# Altium schematic sheet 17.SchDoc
size 386 x 246 mm
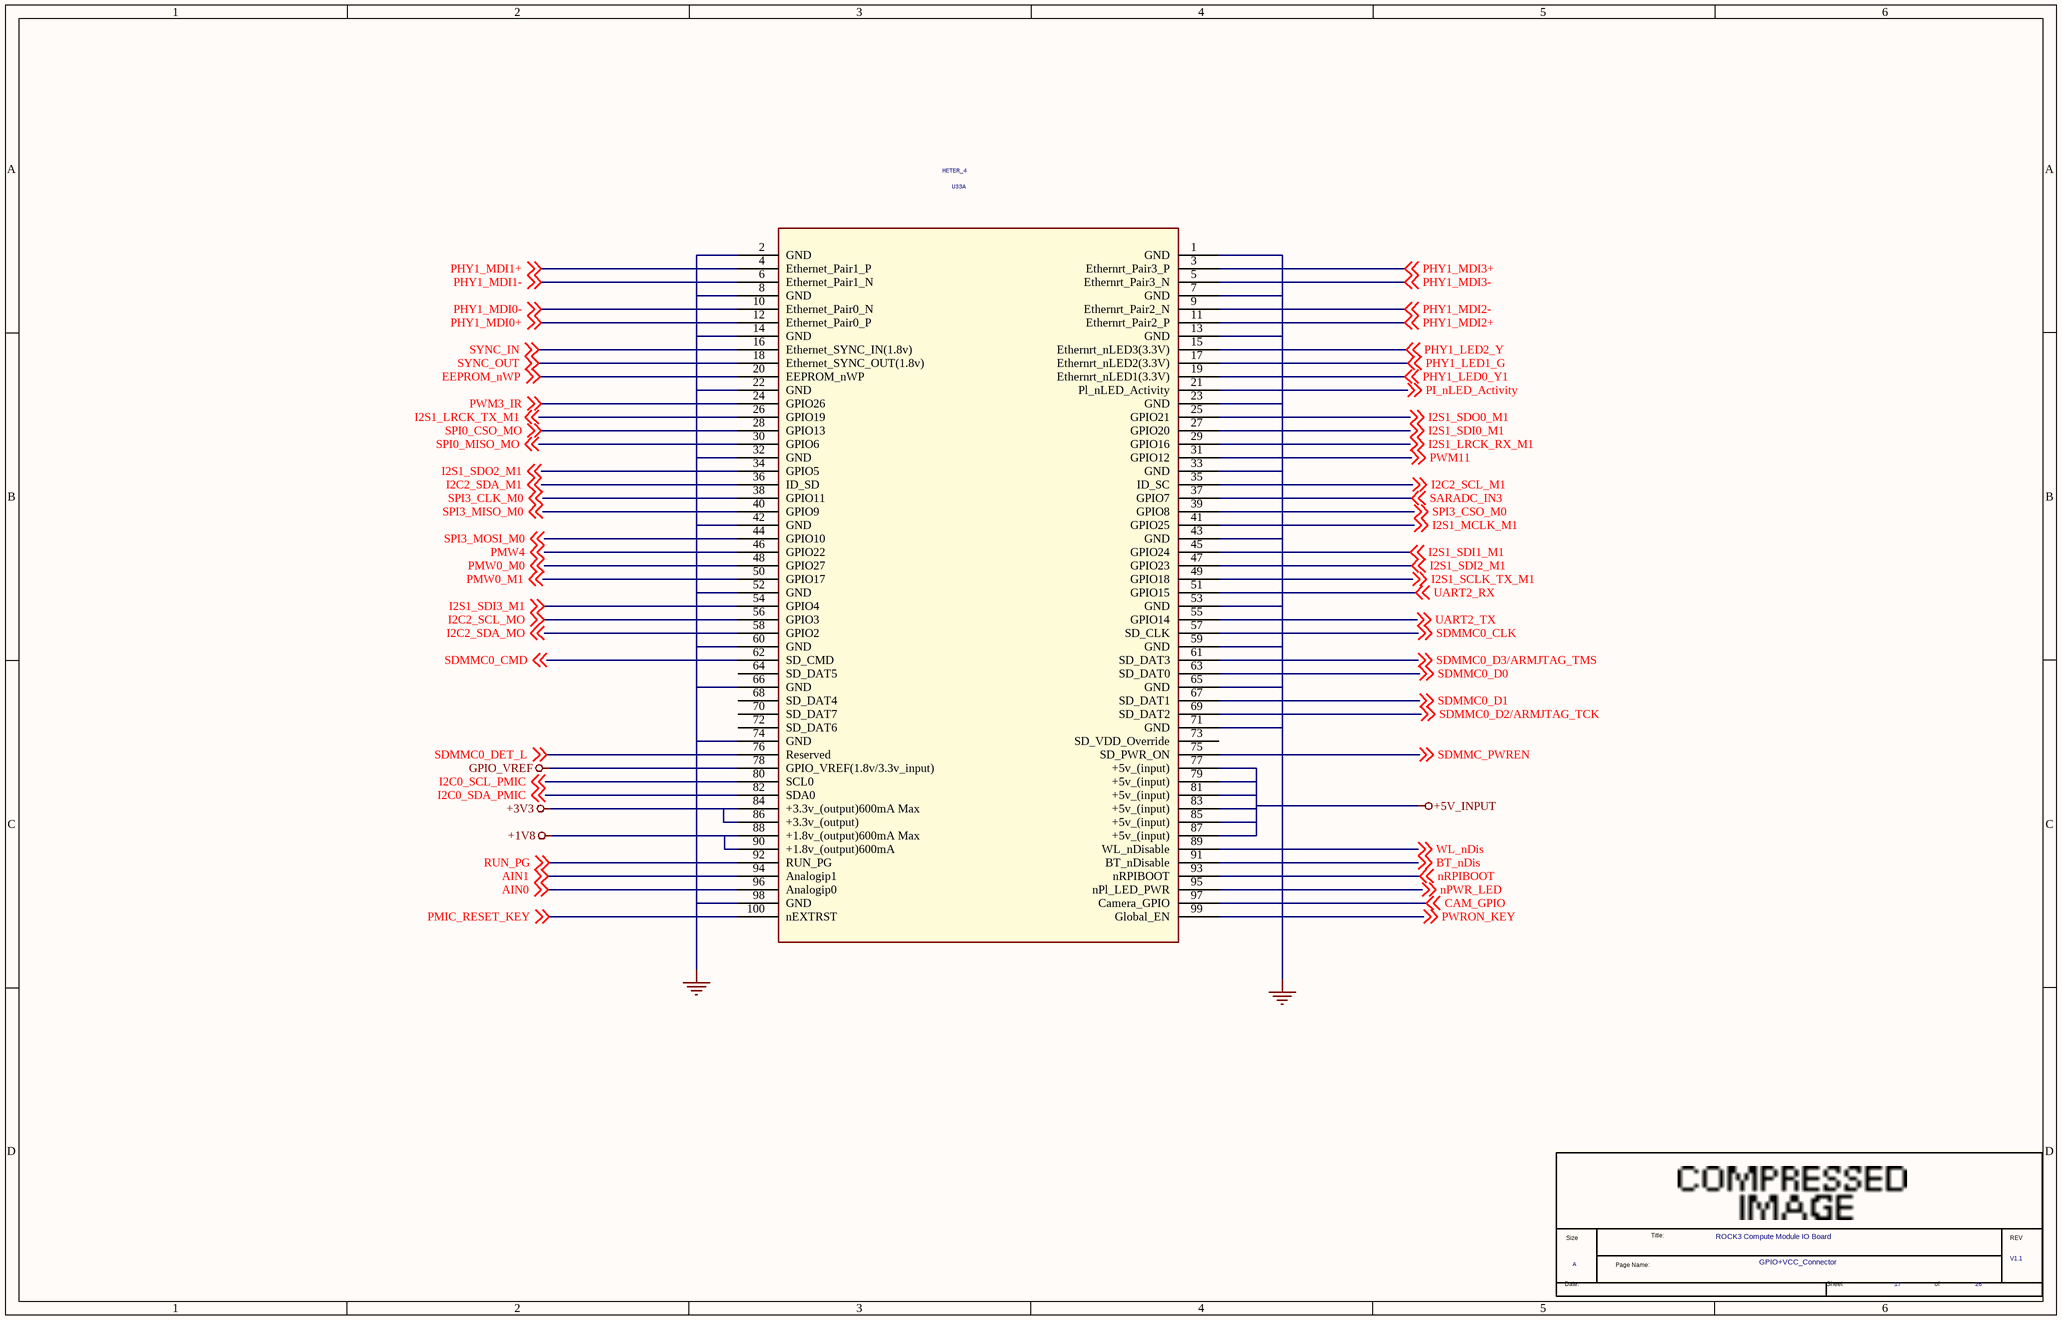
[diagram p0: 17.SchDoc]

## Parts
*  Page Count: 20  Page Number: 17  Page Size: A  Title: ROCK3 Compute Module IO Board  RevCode: V1.1  Doc: GPIO+VCC_Connector  (hidden comment: radxa_gong)  (graphical)
U33  HETER_4  [DF40C-200DS-D4-OK]  (part A of 2)

## Nets
+1V8: U33.88(+1.8v_(output)600mA_Max) U33.90(+1.8v_(output)600mA)
+3V3: U33.84(+3.3v_(output)600mA_Max) U33.86(+3.3v_(output))
+5V_INPUT: U33.77(+5v_(input)) U33.79(+5v_(input)) U33.81(+5v_(input)) U33.83(+5v_(input)) U33.85(+5v_(input)) U33.87(+5v_(input))
GND: U33.1(GND) U33.2(GND) U33.7(GND) U33.8(GND) U33.13(GND) U33.14(GND) U33.22(GND) U33.23(GND) U33.32(GND) U33.33(GND) U33.42(GND) U33.43(GND) U33.52(GND) U33.53(GND) U33.59(GND) U33.60(GND) U33.65(GND) U33.66(GND) U33.71(GND) U33.74(GND) U33.98(GND)
GPIO_VREF: U33.78(GPIO_VREF(1.8v/3.3v_input))
AIN0: U33.96(Analogip0) ; off-sheet AIN0
AIN1: U33.94(Analogip1) ; off-sheet AIN1
BT_nDis: U33.91(BT_nDisable) ; off-sheet BT_nDis
CAM_GPIO: U33.97(Camera_GPIO) ; off-sheet CAM_GPIO
EEPROM_nWP: U33.20(EEPROM_nWP) ; off-sheet EEPROM_nWP
I2C0_SCL_PMIC: U33.80(SCL0) ; off-sheet I2C0_SCL_PMIC
I2C0_SDA_PMIC: U33.82(SDA0) ; off-sheet I2C0_SDA_PMIC
I2C2_SCL_M1: U33.35(ID_SC) ; off-sheet I2C2_SCL_M1
I2C2_SCL_MO: U33.56(GPIO3) ; off-sheet I2C2_SCL_MO
I2C2_SDA_M1: U33.36(ID_SD) ; off-sheet I2C2_SDA_M1
I2C2_SDA_MO: U33.58(GPIO2) ; off-sheet I2C2_SDA_MO
I2S1_LRCK_RX_M1: U33.29(GPIO16) ; off-sheet I2S1_LRCK_RX_M1
I2S1_LRCK_TX_M1: U33.26(GPIO19) ; off-sheet I2S1_LRCK_TX_M1
I2S1_MCLK_M1: U33.41(GPIO25) ; off-sheet I2S1_MCLK_M1
I2S1_SCLK_TX_M1: U33.49(GPIO18) ; off-sheet I2S1_SCLK_TX_M1
I2S1_SDI0_M1: U33.27(GPIO20) ; off-sheet I2S1_SDI0_M1
I2S1_SDI1_M1: U33.45(GPIO24) ; off-sheet I2S1_SDI1_M1
I2S1_SDI2_M1: U33.47(GPIO23) ; off-sheet I2S1_SDI2_M1
I2S1_SDI3_M1: U33.54(GPIO4) ; off-sheet I2S1_SDI3_M1
I2S1_SDO0_M1: U33.25(GPIO21) ; off-sheet I2S1_SDO0_M1
I2S1_SDO2_M1: U33.34(GPIO5) ; off-sheet I2S1_SDO2_M1
nPWR_LED: U33.95(nPl_LED_PWR) ; off-sheet nPWR_LED
nRPIBOOT: U33.93(nRPIBOOT) ; off-sheet nRPIBOOT
PHY1_LED0_Y1: U33.19(Ethernrt_nLED1(3.3V)) ; off-sheet PHY1_LED0_Y1
PHY1_LED1_G: U33.17(Ethernrt_nLED2(3.3V)) ; off-sheet PHY1_LED1_G
PHY1_LED2_Y: U33.15(Ethernrt_nLED3(3.3V)) ; off-sheet PHY1_LED2_Y
PHY1_MDI0+: U33.12(Ethernet_Pair0_P) ; off-sheet PHY1_MDI0+
PHY1_MDI0-: U33.10(Ethernet_Pair0_N) ; off-sheet PHY1_MDI0-
PHY1_MDI1+: U33.4(Ethernet_Pair1_P) ; off-sheet PHY1_MDI1+
PHY1_MDI1-: U33.6(Ethernet_Pair1_N) ; off-sheet PHY1_MDI1-
PHY1_MDI2+: U33.11(Ethernrt_Pair2_P) ; off-sheet PHY1_MDI2+
PHY1_MDI2-: U33.9(Ethernrt_Pair2_N) ; off-sheet PHY1_MDI2-
PHY1_MDI3+: U33.3(Ethernrt_Pair3_P) ; off-sheet PHY1_MDI3+
PHY1_MDI3-: U33.5(Ethernrt_Pair3_N) ; off-sheet PHY1_MDI3-
PI_nLED_Activity: U33.21(Pl_nLED_Activity) ; off-sheet PI_nLED_Activity
PMIC_RESET_KEY: U33.100(nEXTRST) ; off-sheet PMIC_RESET_KEY
PMW0_M0: U33.48(GPIO27) ; off-sheet PMW0_M0
PMW0_M1: U33.50(GPIO17) ; off-sheet PMW0_M1
PMW4: U33.46(GPIO22) ; off-sheet PMW4
PWM3_IR: U33.24(GPIO26) ; off-sheet PWM3_IR
PWM11: U33.31(GPIO12) ; off-sheet PWM11
PWRON_KEY: U33.99(Global_EN) ; off-sheet PWRON_KEY
RUN_PG: U33.92(RUN_PG) ; off-sheet RUN_PG
SARADC_IN3: U33.37(GPIO7) ; off-sheet SARADC_IN3
SDMMC0_CLK: U33.57(SD_CLK) ; off-sheet SDMMC0_CLK
SDMMC0_CMD: U33.62(SD_CMD) ; off-sheet SDMMC0_CMD
SDMMC0_D0: U33.63(SD_DAT0) ; off-sheet SDMMC0_D0
SDMMC0_D1: U33.67(SD_DAT1) ; off-sheet SDMMC0_D1
SDMMC0_D2/ARMJTAG_TCK: U33.69(SD_DAT2) ; off-sheet SDMMC0_D2/ARMJTAG_TCK
SDMMC0_D3/ARMJTAG_TMS: U33.61(SD_DAT3) ; off-sheet SDMMC0_D3/ARMJTAG_TMS
SDMMC0_DET_L: U33.76(Reserved) ; off-sheet SDMMC0_DET_L
SDMMC_PWREN: U33.75(SD_PWR_ON) ; off-sheet SDMMC_PWREN
SPI0_CSO_MO: U33.28(GPIO13) ; off-sheet SPI0_CSO_MO
SPI0_MISO_MO: U33.30(GPIO6) ; off-sheet SPI0_MISO_MO
SPI3_CLK_M0: U33.38(GPIO11) ; off-sheet SPI3_CLK_M0
SPI3_CSO_M0: U33.39(GPIO8) ; off-sheet SPI3_CSO_M0
SPI3_MISO_M0: U33.40(GPIO9) ; off-sheet SPI3_MISO_M0
SPI3_MOSI_M0: U33.44(GPIO10) ; off-sheet SPI3_MOSI_M0
SYNC_IN: U33.16(Ethernet_SYNC_IN(1.8v)) ; off-sheet SYNC_IN
SYNC_OUT: U33.18(Ethernet_SYNC_OUT(1.8v)) ; off-sheet SYNC_OUT
UART2_RX: U33.51(GPIO15) ; off-sheet UART2_RX
UART2_TX: U33.55(GPIO14) ; off-sheet UART2_TX
WL_nDis: U33.89(WL_nDisable) ; off-sheet WL_nDis

Not connected (* = marked no-connect by the designer): U33 64(SD_DAT5) 68(SD_DAT4) 70(SD_DAT7) 72(SD_DAT6) 73(SD_VDD_Override)

## Notes on the sheet
- (in symbol radxa_gong) Size; Title:; REV; Page Name:; Date:; Sheet; of

## Library data of the parts
* = radxa_gong: Page Create Date: March  8, 1995